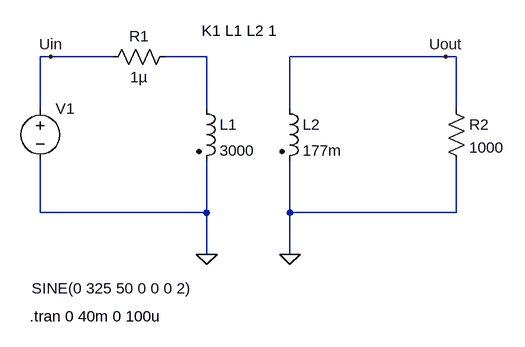
[diagram p0: schematic Draft1.asc]
Draft1.asc, the LTspice schematic file:
Version 4
SHEET 1 880 680
WIRE 80 -48 64 -48
WIRE 176 -48 80 -48
WIRE 320 -48 256 -48
WIRE 688 -48 448 -48
WIRE 704 -48 688 -48
WIRE 64 32 64 -48
WIRE 320 32 320 -48
WIRE 448 32 448 -48
WIRE 704 32 704 -48
WIRE 64 192 64 112
WIRE 320 192 320 112
WIRE 320 192 64 192
WIRE 448 192 448 112
WIRE 704 192 704 112
WIRE 704 192 448 192
WIRE 320 256 320 192
WIRE 448 256 448 192
FLAG 320 256 0
FLAG 448 256 0
FLAG 80 -48 Uin
FLAG 688 -48 Uout
SYMBOL voltage 64 16 R0
WINDOW 3 -13 293 Left 2
WINDOW 123 0 0 Left 0
WINDOW 39 0 0 Left 0
SYMATTR Value SINE(0 325 50 0 0 0 2)
SYMATTR InstName V1
SYMBOL ind2 304 16 R0
SYMATTR InstName L1
SYMATTR Value 3000
SYMATTR Type ind
SYMBOL res 272 -64 R90
WINDOW 0 0 56 VBottom 2
WINDOW 3 32 56 VTop 2
SYMATTR InstName R1
SYMATTR Value 1µ
SYMBOL ind2 432 16 R0
SYMATTR InstName L2
SYMATTR Value 177m
SYMATTR Type ind
SYMBOL res 688 16 R0
SYMATTR InstName R2
SYMATTR Value 1000
TEXT 48 352 Left 2 !.tran 0 40m 0 100u
TEXT 312 -88 Left 2 !K1 L1 L2 1

The netlist it stands for:
* Draft1.asc
V1 Uin 0 SINE(0 325 50 0 0 0 2)
L1 N001 0 3000
R1 N001 Uin 1µ
L2 Uout 0 177m
R2 Uout 0 1000
.tran 0 40m 0 100u
K1 L1 L2 1
.backanno
.end

* Results of the author's LTspice run, read from the files saved beside the schematic
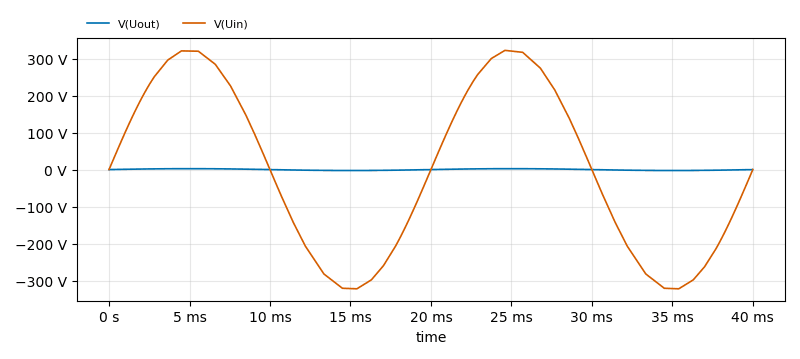
[diagram p1: Transient Analysis of Draft1.asc, plotted from the saved traces]
* Transient Analysis, 1 run:
*   V(Uout): min -2.476 V, max 2.476 V, average 299.8 µV, rms 1.758 V, last 0 V
*   V(Uin): min -322.4 V, max 322.4 V, average 39.04 mV, rms 228.9 V, last 0 V